# Altium schematic sheet LED.SchDoc
size A4
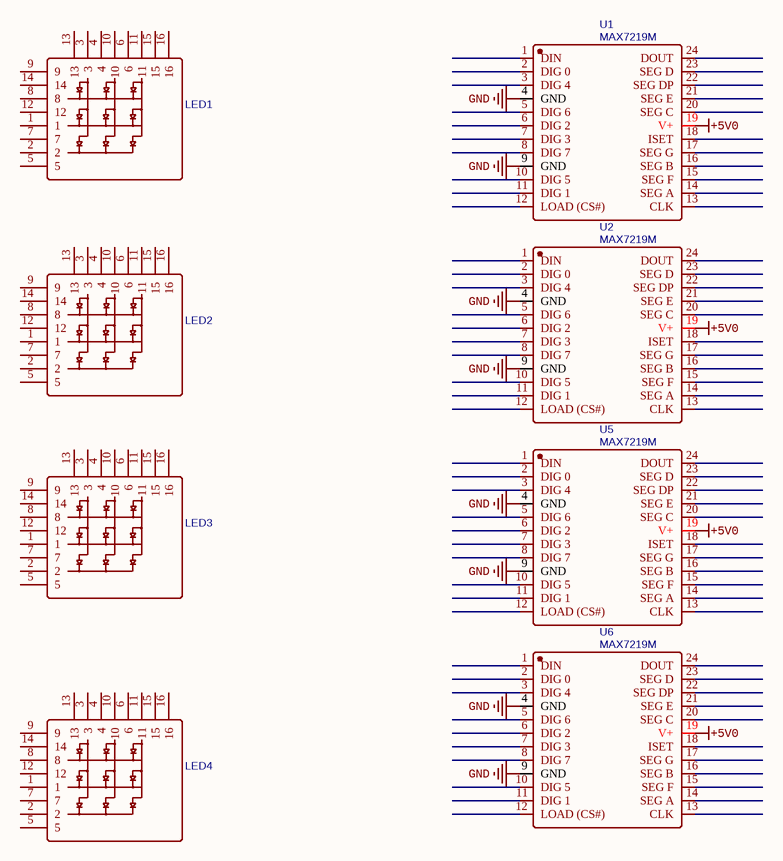
[diagram p0: LED.SchDoc]

## Parts
LED1  (no value)  [matrix_led]
LED2  (no value)  [matrix_led]
LED3  (no value)  [matrix_led]
LED4  (no value)  [matrix_led]
U1  MAX7219M  [SOP-24_300mil]
U2  MAX7219M  [SOP-24_300mil]
U5  MAX7219M  [SOP-24_300mil]
U6  MAX7219M  [SOP-24_300mil]

## Nets
+5V0: U1.19(V+) U2.19(V+) U5.19(V+) U6.19(V+)
GND: U1.4(GND) U1.9(GND) U2.4(GND) U2.9(GND) U5.4(GND) U5.9(GND) U6.4(GND) U6.9(GND)

Not connected (* = marked no-connect by the designer): LED1 1 2 3 4 5 6 7 8 9 10 11 12 13 14 15 16; LED2 1 2 3 4 5 6 7 8 9 10 11 12 13 14 15 16; LED3 1 2 3 4 5 6 7 8 9 10 11 12 13 14 15 16; LED4 1 2 3 4 5 6 7 8 9 10 11 12 13 14 15 16; U1 1(DIN) 2(DIG_0) 3(DIG_4) 5(DIG_6) 6(DIG_2) 7(DIG_3) 8(DIG_7) 10(DIG_5) 11(DIG_1) 12(LOAD_(CS#)) 13(CLK) 14(SEG_A) 15(SEG_F) 16(SEG_B) 17(SEG_G) 18(ISET) 20(SEG_C) 21(SEG_E) 22(SEG_DP) 23(SEG_D) 24(DOUT); U2 1(DIN) 2(DIG_0) 3(DIG_4) 5(DIG_6) 6(DIG_2) 7(DIG_3) 8(DIG_7) 10(DIG_5) 11(DIG_1) 12(LOAD_(CS#)) 13(CLK) 14(SEG_A) 15(SEG_F) 16(SEG_B) 17(SEG_G) 18(ISET) 20(SEG_C) 21(SEG_E) 22(SEG_DP) 23(SEG_D) 24(DOUT); U5 1(DIN) 2(DIG_0) 3(DIG_4) 5(DIG_6) 6(DIG_2) 7(DIG_3) 8(DIG_7) 10(DIG_5) 11(DIG_1) 12(LOAD_(CS#)) 13(CLK) 14(SEG_A) 15(SEG_F) 16(SEG_B) 17(SEG_G) 18(ISET) 20(SEG_C) 21(SEG_E) 22(SEG_DP) 23(SEG_D) 24(DOUT); U6 1(DIN) 2(DIG_0) 3(DIG_4) 5(DIG_6) 6(DIG_2) 7(DIG_3) 8(DIG_7) 10(DIG_5) 11(DIG_1) 12(LOAD_(CS#)) 13(CLK) 14(SEG_A) 15(SEG_F) 16(SEG_B) 17(SEG_G) 18(ISET) 20(SEG_C) 21(SEG_E) 22(SEG_DP) 23(SEG_D) 24(DOUT)

## Library data of the parts
LED1-LED4 = SLD0888DWC1BY: BOM_Manufacturer: SUNLIGHT; Contributor: LCSC; BOM_Supplier: LCSC; BOM_Supplier Part: C225986; BOM_Manufacturer Part: SLD0888DWC1BY; BOM_JLCPCB Part Class: Extended Part; spicePre: L; spiceSymbolName: SLD0888DWC1BY
U1 U2 U5 U6 = MAX7219M: BOM_Manufacturer: HGSEMI(华冠); Contributor: LCSC; BOM_Supplier: LCSC; BOM_Supplier Part: C492110; BOM_Manufacturer Part: MAX7219M; BOM_JLCPCB Part Class: Extended Part; spicePre: U; spiceSymbolName: MAX7219M